# Altium schematic sheet Cover Page.SchDoc
size A3; SheetNumber: 2; SheetTotal: 12
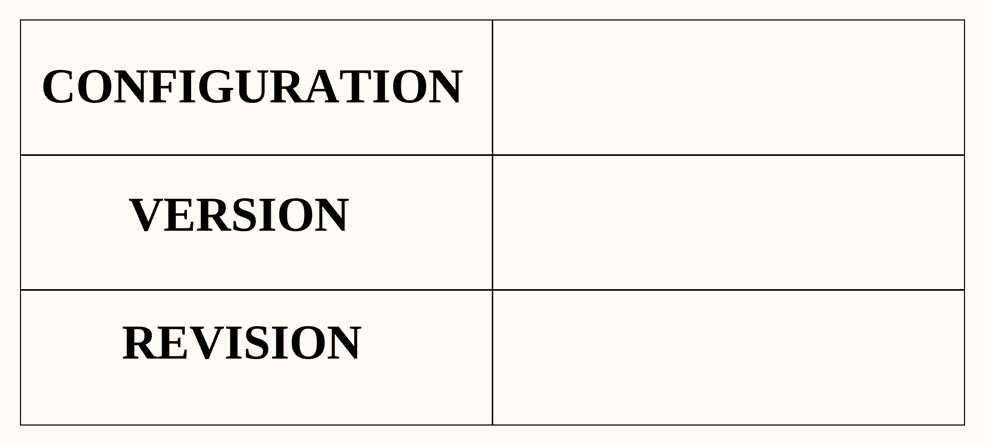
[diagram p0: Cover Page.SchDoc]

## Notes on the sheet
- CONFIGURATION
- VERSION
- REVISION